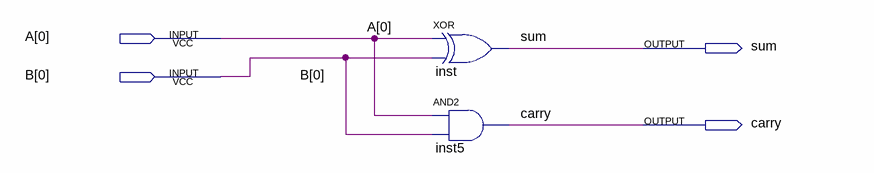
[diagram p0: schematic sheet]
// Quartus schematic g54_halfadder.bdf as structural Verilog: 2 symbols, 4 pins
module g54_halfadder (
  input  [0:0] A,
  input  [0:0] B,
  output sum,
  output carry
);

  xor inst (sum, A[0], B[0]);
  and inst5 (carry, A[0], B[0]);
endmodule
